# EasyEDA schematic SCH_Carte_des_boutons_capacitives_2025-09-15.json
TITLE: Sheet_1; REV: 1.0; Date: 2025-09-08; Sheet: 1/1; Company: Your Company
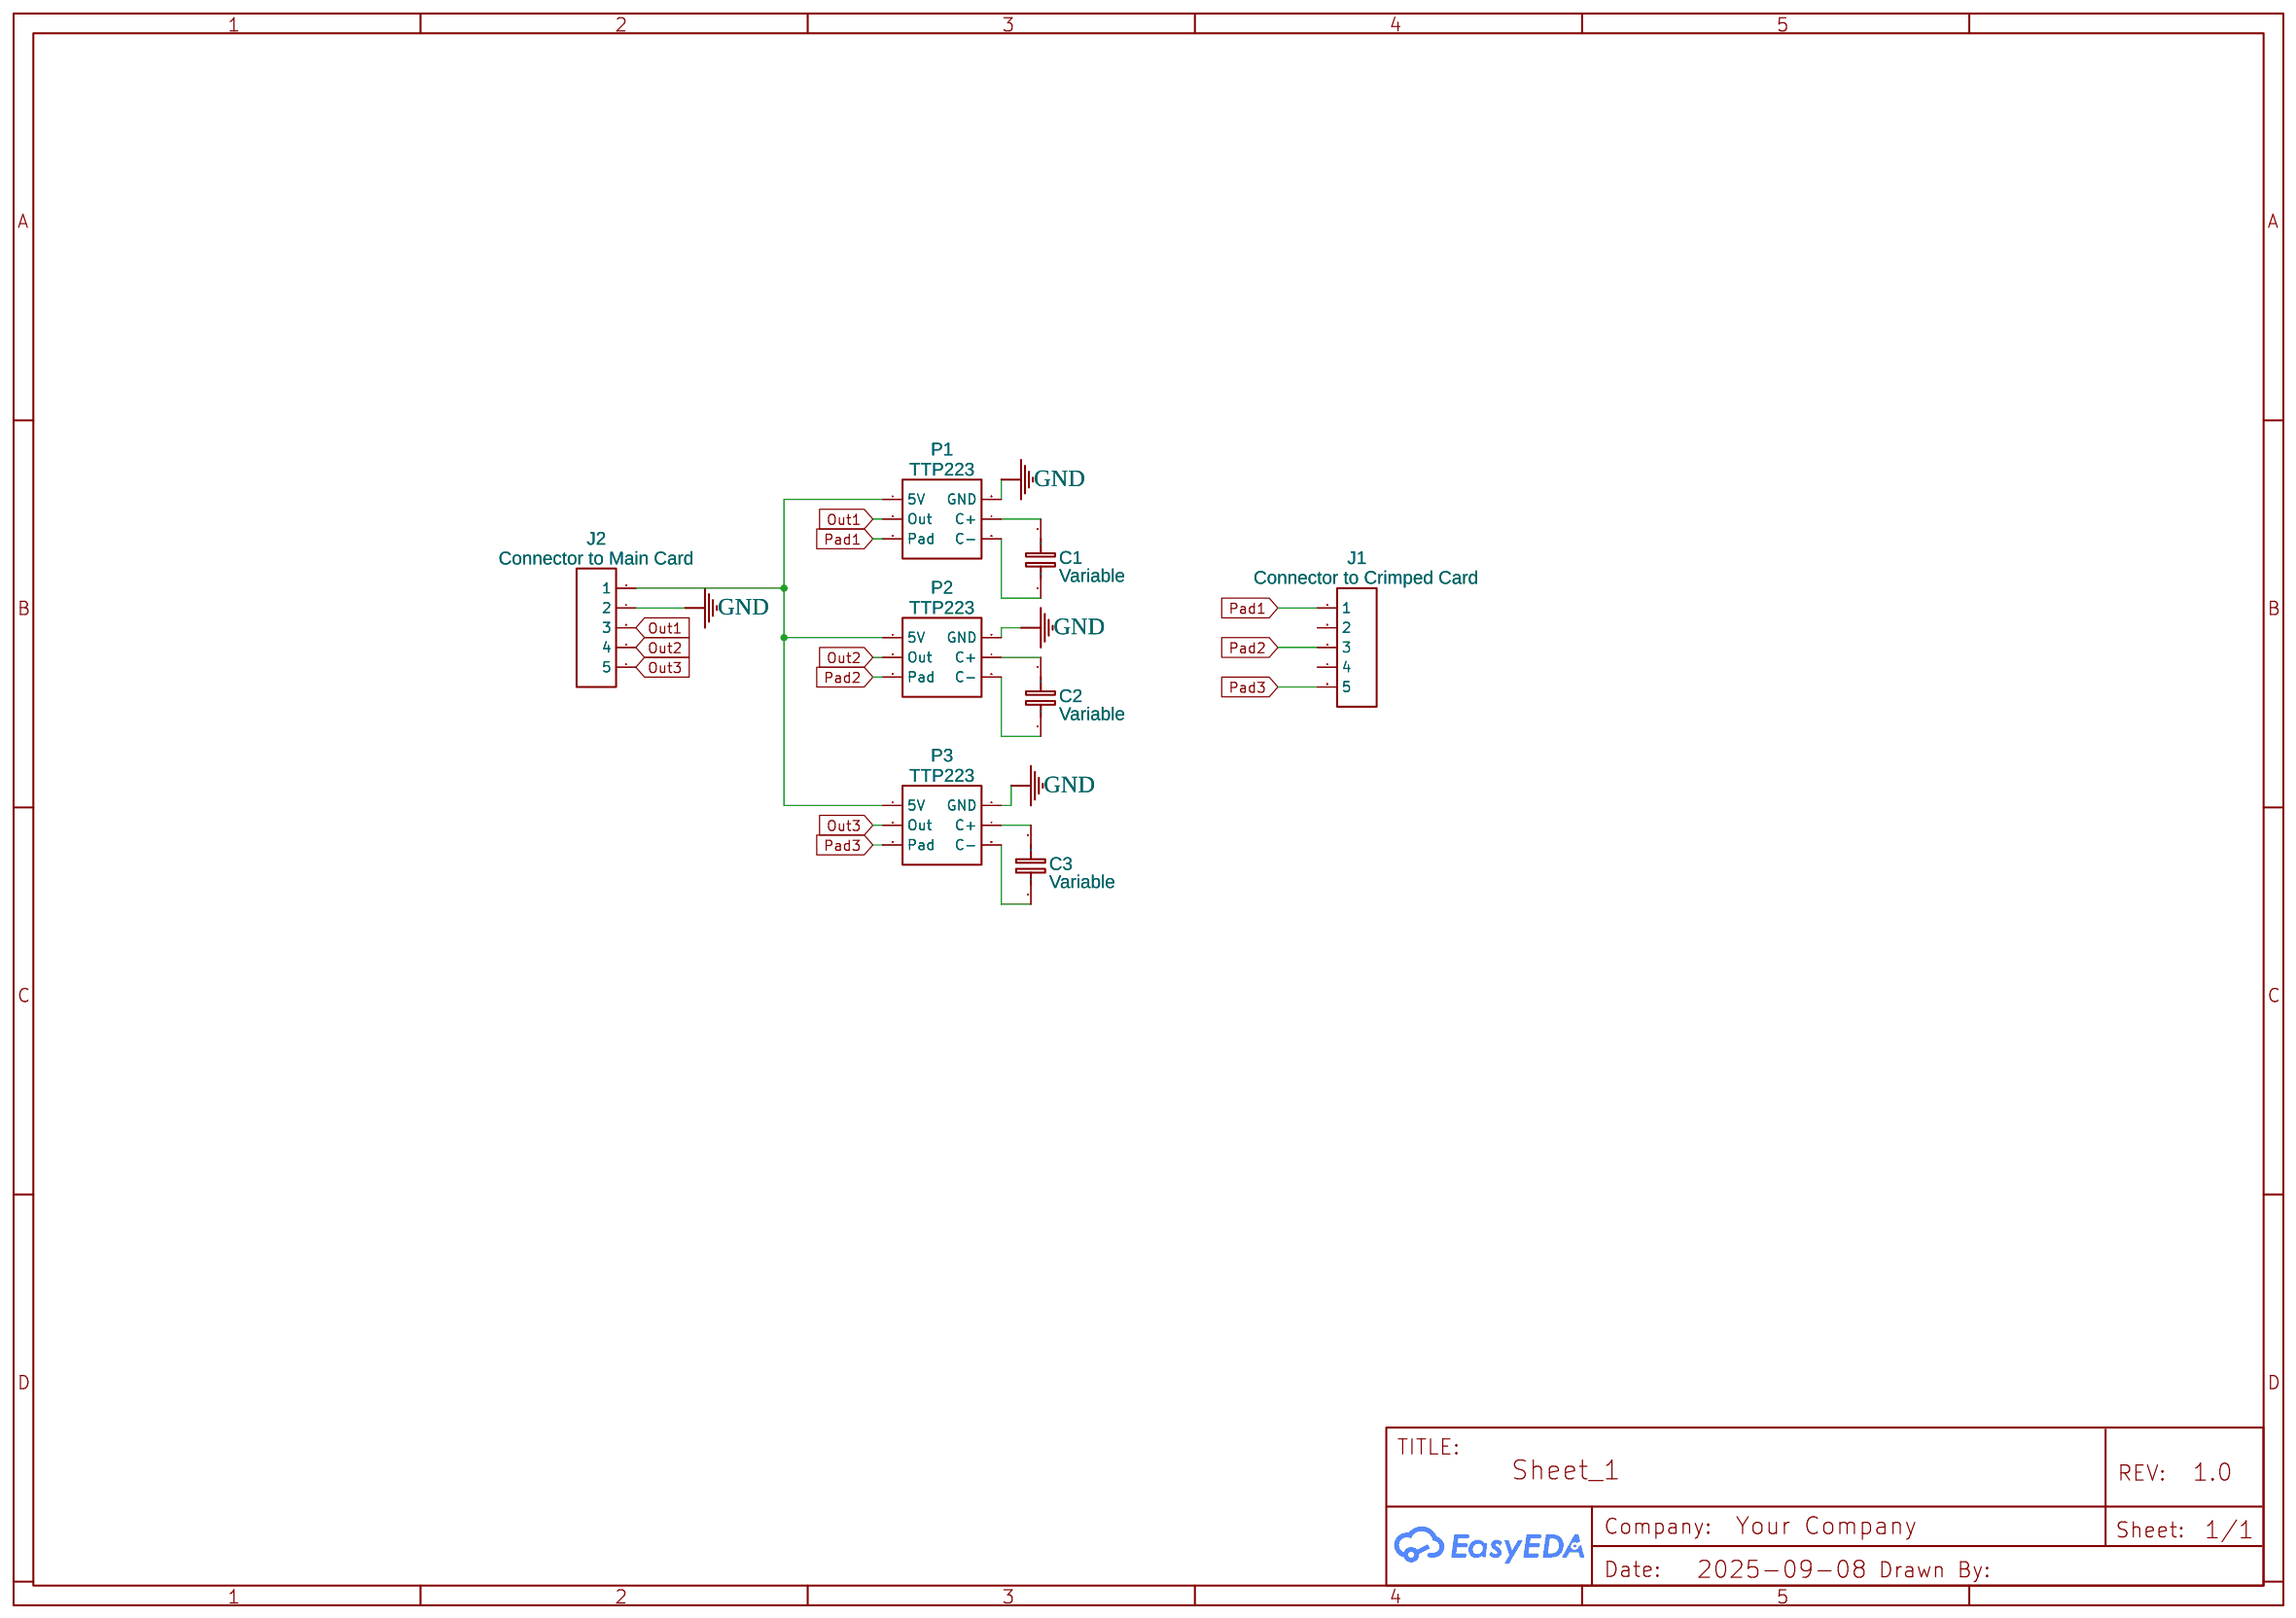
[diagram p0: schematic sheet]

## Parts
C1  Variable  [C0603]
C2  Variable  [C0603]
C3  Variable  [C0603]
J1  Connector to Crimped Card  [HDR-M-2.54_1X5]
J2  Connector to Main Card  [HDR-M-2.54_1X5]
P1  TTP223  [IDC-TH_6P-P2.54_C11214]
P2  TTP223  [IDC-TH_6P-P2.54_C11214]
P3  TTP223  [IDC-TH_6P-P2.54_C11214]

## Library data of the parts
C1-C3 = C_0603_EU: Contributor: LCEDA_Lib
J1 J2 = HDR-M-2.54_1x5: Supplier Part: C358687; Supplier: LCSC; Contributor: LCEDA_Lib
P1-P3 = HDR-IDC-2.54-2X3P: Supplier: LCSC; Manufacturer: BOOMELE; Manufacturer Part: 2X3 2.54mm IDC Box; image: //image.lceda.cn/szlcsc/C11214.jpg; Supplier Part: C11214

## Nets
GND: J2.4(2) P1.2(GND) P2.2(GND) P3.2(GND)
Out1: J2.3 P1.3(Out)
Out2: J2.2(4) P2.3(Out)
Out3: J2.1(5) P3.3(Out)
Pad1: J1.1 P1.5(Pad)
Pad2: J1.3 P2.5(Pad)
Pad3: J1.5 P3.5(Pad)
Net-(C1-1): C1.1 P1.6(C-)
Net-(C1-2): C1.2 P1.4(C+)
Net-(C2-1): C2.1 P2.6(C-)
Net-(C2-2): C2.2 P2.4(C+)
Net-(C3-1): C3.1 P3.6(C-)
Net-(C3-2): C3.2 P3.4(C+)
Net-(J2-5): J2.5(1) P1.1(5V) P2.1(5V) P3.1(5V)

Not connected (* = marked no-connect by the designer): J1 2 4
